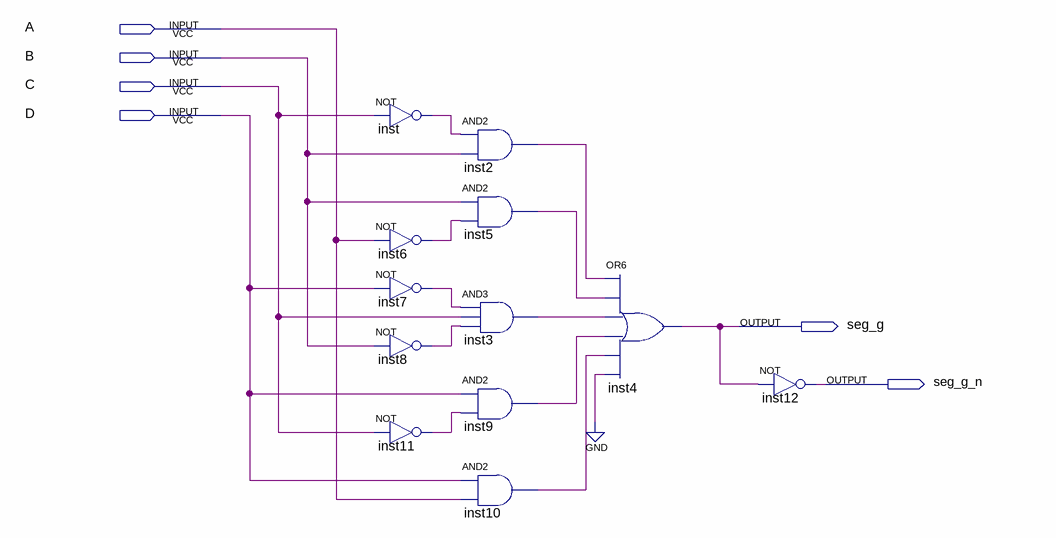
[diagram p0: schematic sheet]
// Quartus schematic segmento_g.bdf as structural Verilog: 12 symbols, 6 pins
module segmento_g (
  input  A,
  input  B,
  input  C,
  input  D,
  output seg_g,
  output seg_g_n
);

  wire inst2_out, inst3_out, inst5_out, inst6_out, inst7_out, inst8_out, inst9_out, inst10_out, inst11_out,
       inst_out;

  not inst (inst_out, C);
  not inst6 (inst6_out, A);
  not inst7 (inst7_out, D);
  not inst8 (inst8_out, B);
  not inst11 (inst11_out, C);
  and inst2 (inst2_out, inst_out, B);
  and inst5 (inst5_out, B, inst6_out);
  and inst3 (inst3_out, inst7_out, C, inst8_out);
  and inst9 (inst9_out, D, inst11_out);
  and inst10 (inst10_out, D, A);
  or inst4 (seg_g, inst2_out, inst5_out, inst3_out, inst9_out, inst10_out, 1'b0);
  not inst12 (seg_g_n, seg_g);
endmodule
